# Altium schematic sheet Sheet_1_2025-06-27.schdoc
size 269 x 111 mm
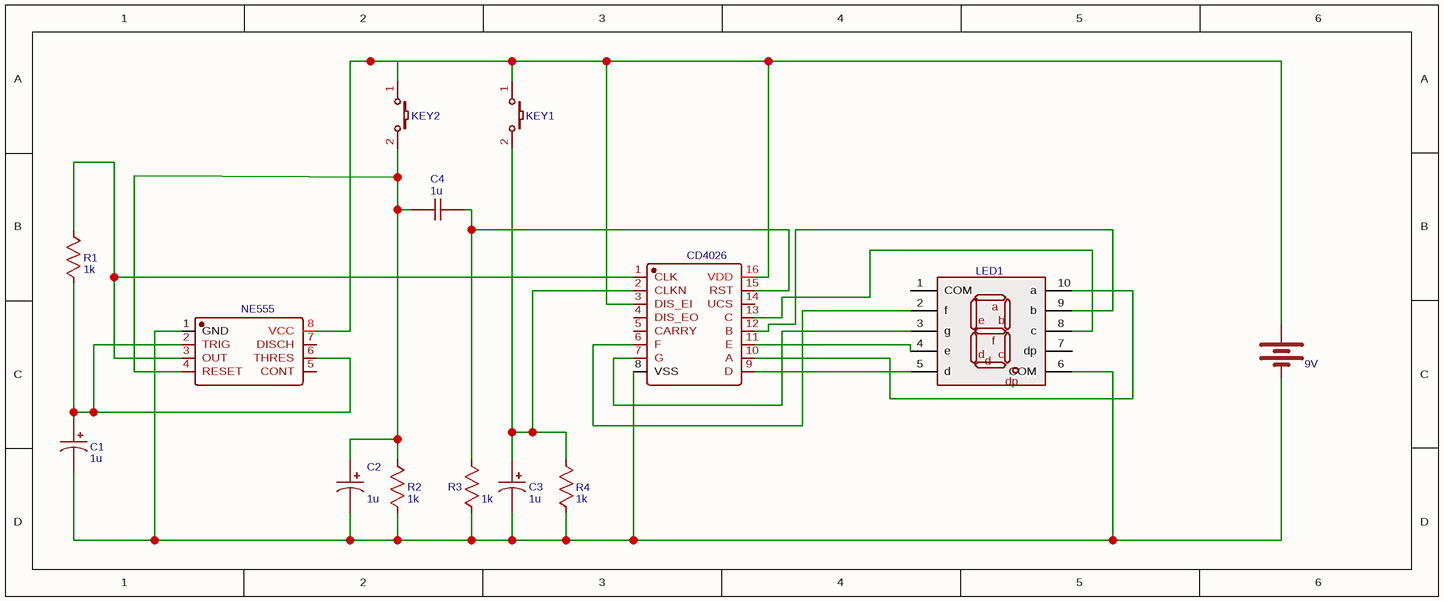
[diagram p0: Sheet_1_2025-06-27.schdoc]

## Parts
BT1  9V  [BAT-TH_2P-9VBATTERY]
C1  1u  [CAP-D4.0×H5.5]
C2  1u  [CAP-D4.0×H5.5]
C3  1u  [CAP-D4.0×H5.5]
C4  1u  [RAD-0.1]
KEY1  K2-3.6×6.1_SMD  [KEY-SMD_2P-L6.2-W3.6-LS8.0]  (value not drawn)
KEY2  K2-3.6×6.1_SMD  [KEY-SMD_2P-L6.2-W3.6-LS8.0]  (value not drawn)
LED1  FJ3161BH  [LED-SEG-TH_FJ3161BH]  (value not drawn)
R1  1k  [R_AXIAL-0.3]
R2  1k  [R_AXIAL-0.3]
R3  1k  [R_AXIAL-0.3]
R4  1k  [R_AXIAL-0.3]
U1  NE555  [PDIP-8_L9.6-W6.4-P2.54-LS7.9-BL-1]
U2  CD4026  [PDIP-16_L19.3-W6.4-P2.54-LS7.94-BL]

## Nets
NetBT1_1: BT1.1(+) KEY1.1 KEY2.1 U1.8(VCC) U2.3(DIS_EI) U2.16(VDD)
NetBT1_2: BT1.2(-) C1.2 C2.2 C3.2 LED1.6(COM) R2.1 R3.1 R4.1 U1.1(GND) U2.8(VSS)
NetC1_1: C1.1 R1.1 U1.2(TRIG) U1.6(THRES)
NetC2_1: C2.1 C4.1 KEY2.2 R2.2 U1.4(RESET)
NetC3_1: C3.1 KEY1.2 R4.2 U2.2(CLKN)
NetC4_2: C4.2 R3.2 U2.15(RST)
NetLED1_2: LED1.2(f) U2.6(F)
NetLED1_3: LED1.3(g) U2.7(G)
NetLED1_4: LED1.4(e) U2.11(E)
NetLED1_5: LED1.5(d) U2.9(D)
NetLED1_8: LED1.8(c) U2.13(C)
NetLED1_9: LED1.9(b) U2.12(B)
NetLED1_10: LED1.10(a) U2.10(A)
NetR1_2: R1.2 U1.3(OUT) U2.1(CLK)

Not connected (* = marked no-connect by the designer): LED1 1(COM) 7(dp); U1 5(CONT) 7(DISCH); U2 4(DIS_EO) 5(CARRY) 14(UCS)

## Library data of the parts
BT1 = 9V: Manufacturer: Q&J; Manufacturer Part: 9V电池铜线扣 铜100mm; Contributor: lcsc; Supplier: LCSC; Supplier Part: C70374; JLCPCB Part Class: Extended Part; spicePre: B; spiceSymbolName: 9V电池铜线扣 铜100MM
C1-C4 = 1u: nameAlias: Value(F); Contributor: LCEDA_Lib; spicePre: C
  C1-C3: spiceSymbolName: CE_SMD_D4.0×H5.5_US
  C4: spiceSymbolName: C_RAD-0.1_US
KEY1 KEY2 = K2-3.6×6.1_SMD: Manufacturer Part: K2-1107ST-A4SW-06; Contributor: LCEDA_Lib; 制造商: 韩国韩荣; Supplier Part: C118141; Supplier: LCSC; spicePre: K; spiceSymbolName: K2-3.6×6.1_SMD
LED1 = FJ3161BH: Manufacturer: 志浩; Supplier: LCSC; Manufacturer Part: FJ3161BH; Supplier Part: C10690; JLCPCB Part Class: Extended Part; spicePre: L; spiceSymbolName: FJ3161BH
R1-R4 = 1k: nameAlias: Value(Ω); Contributor: LCEDA_Lib; spicePre: R; spiceSymbolName: R_AXIAL-0.3_US
U1 = NE555: Manufacturer: TI(德州仪器); Manufacturer Part: NE555PE4; Contributor: lcsc; Supplier: LCSC; Supplier Part: C2859604; JLCPCB Part Class: Extended Part; spicePre: U; spiceSymbolName: NE555PE4
U2 = CD4026: Manufacturer: LX(灵星芯微); Manufacturer Part: CD4026BE(LX); Contributor: lcsc; Supplier: LCSC; Supplier Part: C22397238; JLCPCB Part Class: Extended Part; spicePre: U; spiceSymbolName: CD4026BE(LX)